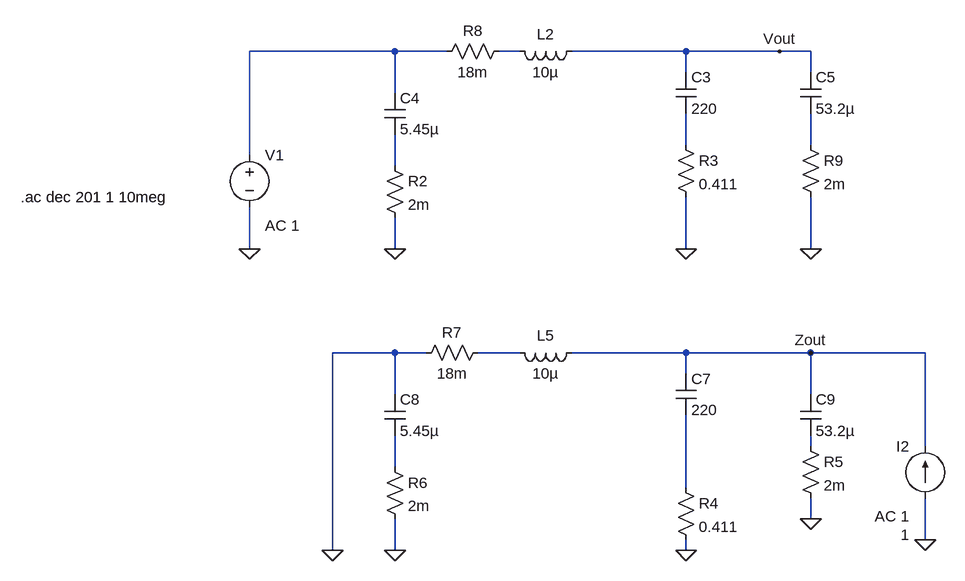
[diagram p0: schematic input filter.asc]
input filter.asc, the LTspice schematic file:
Version 4
SHEET 1 1444 2400
WIRE 240 1456 16 1456
WIRE 320 1456 240 1456
WIRE 432 1456 400 1456
WIRE 688 1456 512 1456
WIRE 832 1456 688 1456
WIRE 880 1456 832 1456
WIRE 688 1488 688 1456
WIRE 880 1488 880 1456
WIRE 240 1520 240 1456
WIRE 688 1600 688 1552
WIRE 880 1600 880 1552
WIRE 16 1616 16 1456
WIRE 240 1632 240 1584
WIRE 16 1760 16 1696
WIRE 240 1760 240 1712
WIRE 688 1760 688 1680
WIRE 880 1760 880 1680
WIRE 240 1920 144 1920
WIRE 288 1920 240 1920
WIRE 432 1920 368 1920
WIRE 688 1920 512 1920
WIRE 880 1920 688 1920
WIRE 1056 1920 880 1920
WIRE 688 1952 688 1920
WIRE 240 1984 240 1920
WIRE 880 1984 880 1920
WIRE 880 2064 880 2048
WIRE 1056 2064 1056 1920
WIRE 240 2096 240 2048
WIRE 688 2128 688 2016
WIRE 880 2176 880 2144
WIRE 1056 2208 1056 2144
WIRE 144 2224 144 1920
WIRE 240 2224 240 2176
WIRE 688 2224 688 2208
FLAG 16 1760 0
FLAG 688 1760 0
FLAG 240 1760 0
FLAG 880 1760 0
FLAG 1056 2208 0
FLAG 688 2224 0
FLAG 240 2224 0
FLAG 880 2176 0
FLAG 144 2224 0
FLAG 880 1920 Zout
FLAG 832 1456 Vout
SYMBOL ind 528 1440 R90
WINDOW 0 5 56 VBottom 2
WINDOW 3 32 56 VTop 2
SYMATTR InstName L2
SYMATTR Value 10µ
SYMBOL res 672 1584 R0
SYMATTR InstName R3
SYMATTR Value 0.411
SYMBOL cap 672 1488 R0
SYMATTR InstName C3
SYMATTR Value 220
SYMBOL cap 224 1520 R0
SYMATTR InstName C4
SYMATTR Value 5.45µ
SYMBOL cap 864 1488 R0
SYMATTR InstName C5
SYMATTR Value 53.2µ
SYMBOL ind 528 1904 R90
WINDOW 0 5 56 VBottom 2
WINDOW 3 32 56 VTop 2
SYMATTR InstName L5
SYMATTR Value 10µ
SYMBOL res 672 2112 R0
SYMATTR InstName R4
SYMATTR Value 0.411
SYMATTR SpiceLine pwr=1
SYMBOL cap 672 1952 R0
SYMATTR InstName C7
SYMATTR Value 220
SYMBOL cap 224 1984 R0
SYMATTR InstName C8
SYMATTR Value 5.45µ
SYMBOL cap 864 1984 R0
SYMATTR InstName C9
SYMATTR Value 53.2µ
SYMBOL current 1056 2144 R180
WINDOW 0 24 80 Left 2
WINDOW 3 24 -56 Left 2
WINDOW 123 24 -28 Left 2
WINDOW 39 0 0 Left 0
SYMATTR InstName I2
SYMATTR Value 1
SYMATTR Value2 AC 1
SYMBOL res 864 2048 R0
SYMATTR InstName R5
SYMATTR Value 2m
SYMBOL res 224 2080 R0
SYMATTR InstName R6
SYMATTR Value 2m
SYMBOL res 384 1904 R90
WINDOW 0 0 56 VBottom 2
WINDOW 3 32 56 VTop 2
SYMATTR InstName R7
SYMATTR Value 18m
SYMBOL voltage 16 1600 R0
WINDOW 123 24 124 Left 2
WINDOW 39 0 0 Left 0
SYMATTR InstName V1
SYMATTR Value ""
SYMATTR Value2 AC 1
SYMBOL res 224 1616 R0
SYMATTR InstName R2
SYMATTR Value 2m
SYMBOL res 416 1440 R90
WINDOW 0 0 56 VBottom 2
WINDOW 3 32 56 VTop 2
SYMATTR InstName R8
SYMATTR Value 18m
SYMBOL res 864 1584 R0
SYMATTR InstName R9
SYMATTR Value 2m
TEXT -336 1680 Left 2 !.ac dec 201 1 10meg

The netlist it stands for:
* input filter.asc
L2 Vout N002 10µ
R3 N003 0 0.411
C3 Vout N003 220
C4 N001 N005 5.45µ
C5 Vout N004 53.2µ
L5 Zout N006 10µ
R4 N009 0 0.411 pwr=1
C7 Zout N009 220
C8 0 N008 5.45µ
C9 Zout N007 53.2µ
I2 0 Zout 1 AC 1
R5 N007 0 2m
R6 N008 0 2m
R7 N006 0 18m
V1 N001 0 AC 1
R2 N005 0 2m
R8 N002 N001 18m
R9 N004 0 2m
.ac dec 201 1 10meg
.backanno
.end